# Altium schematic sheet DevModule.SchDoc
size A
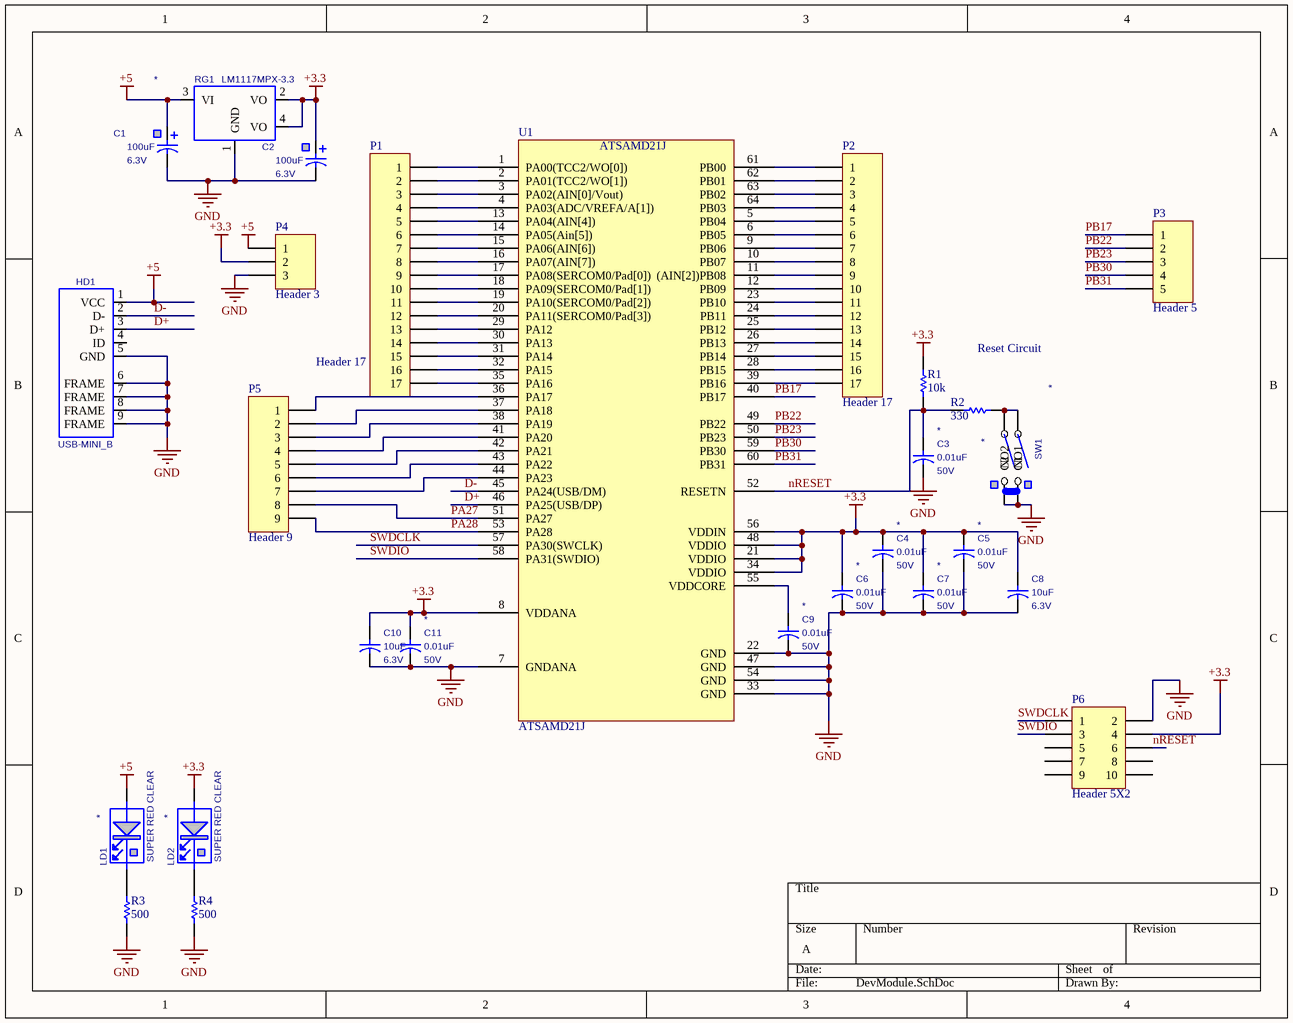
[diagram p0: DevModule.SchDoc]

## Parts
C1  value 100uF  Voltage: 6.3V  [100uF_6.3V_Tant_0805]  (hidden comment: 100UF_TANT_6.3V_0805)
C2  value 100uF  Voltage: 6.3V  [100uF_6.3V_Tant_0805]  (hidden comment: 100UF_TANT_6.3V_0805)
C3  value 0.01uF  Voltage: 50V  [RC0603REFLOW-IPC]  (hidden comment: 0.01UF_0603REFLOW)
C4  value 0.01uF  Voltage: 50V  [RC0603REFLOW-IPC]  (hidden comment: 0.01UF_0603REFLOW)
C5  value 0.01uF  Voltage: 50V  [RC0603REFLOW-IPC]  (hidden comment: 0.01UF_0603REFLOW)
C6  value 0.01uF  Voltage: 50V  [RC0603REFLOW-IPC]  (hidden comment: 0.01UF_0603REFLOW)
C7  value 0.01uF  Voltage: 50V  [RC0603REFLOW-IPC]  (hidden comment: 0.01UF_0603REFLOW)
C8  value 10uF  Voltage: 6.3V  [1206_NP_CAP]  (hidden comment: 10uF_Ceramic_6.3V)
C9  value 0.01uF  Voltage: 50V  [RC0603REFLOW-IPC]  (hidden comment: 0.01UF_0603REFLOW)
C10  value 10uF  Voltage: 6.3V  [1206_NP_CAP]  (hidden comment: 10uF_Ceramic_6.3V)
C11  value 0.01uF  Voltage: 50V  [RC0603REFLOW-IPC]  (hidden comment: 0.01UF_0603REFLOW)
HD1  USB-MINI_B  [HD_USB_MINI_B]
LD1  Color: SUPER RED CLEAR  [LED0603REFLOW-IPC-COLOR]  (hidden comment: 0603_RED)
LD2  Color: SUPER RED CLEAR  [LED0603REFLOW-IPC-COLOR]  (hidden comment: 0603_RED)
P1  Header 17  [HDR1X17]
P2  Header 17  [HDR1X17]
P3  Header 5  [HDR1X5]
P4  Header 3  [HDR1X3]
P5  Header 9  [HDR1X9]
P6  Header 5X2  [HDR2X5]
R1  value 10k  [RESC2012L]  (hidden comment: Res Semi)
R2  value 330  [RESC2012L]  (hidden comment: Res Semi)
R3  value 500  [RESC2012L]  (hidden comment: Res Semi)
R4  value 500  [RESC2012L]  (hidden comment: Res Semi)
RG1  value LM1117MPX-3.3  [SOT223REFLOW]  (hidden comment: LM1117SPX-3.3_SOT223)
SW1  SW-PCB-4P-6MM  [SW-PCB-4PIN]  (value not drawn)
U1  ATSAMD21J  [64-TQFP]

## Nets
+3.3: C2.1(+) C4.1(pin1) C5.1(pin1) C6.1(pin1) C7.1(pin1) C8.1(pin1) C10.1(pin1) C11.1(pin1) LD2.2(ANODE) P4.2 P6.4 R1.2 RG1.2(VO) RG1.4(VO) U1.8(VDDANA) U1.21(VDDIO) U1.34(VDDIO) U1.48(VDDIO) U1.56(VDDIN)
+5: C1.1(+) HD1.1(VCC) LD1.2(ANODE) P4.1 RG1.3(VI)
GND: C1.2(-) C2.2(-) C3.2(pin2) C4.2(pin2) C5.2(pin2) C6.2(pin2) C7.2(pin2) C8.2(pin2) C9.2(pin2) C10.2(pin2) C11.2(pin2) HD1.5(GND) HD1.6(FRAME) HD1.7(FRAME) HD1.8(FRAME) HD1.9(FRAME) P4.3 P6.2 R3.1 R4.1 RG1.1(GND) SW1.1(C1) SW1.2(C2) U1.7(GNDANA) U1.22(GND) U1.33(GND) U1.47(GND) U1.54(GND)
D+: HD1.3(D+) U1.46(PA25(USB/DP))
D-: HD1.2(D-) U1.45(PA24(USB/DM))
nRESET: C3.1(pin1) P6.6 R1.1 R2.1 U1.52(RESETN)
PA27: P5.8 U1.51(PA27)
PA28: P5.9 U1.53(PA28)
PB17: P3.1 U1.40(PB17)
PB22: P3.2 U1.49(PB22)
PB23: P3.3 U1.50(PB23)
PB30: P3.4 U1.59(PB30)
PB31: P3.5 U1.60(PB31)
SWDCLK: P6.1 U1.57(PA30(SWCLK))
SWDIO: P6.3 U1.58(PA31(SWDIO))
NetC9_1: C9.1(pin1) U1.55(VDDCORE)
NetLD1_1: LD1.1(CATHODE) R3.2
NetLD2_1: LD2.1(CATHODE) R4.2
NetP1_1: P1.1 U1.1(PA00(TCC2/WO[0]))
NetP1_2: P1.2 U1.2(PA01(TCC2/WO[1]))
NetP1_3: P1.3 U1.3(PA02(AIN[0]/Vout))
NetP1_4: P1.4 U1.4(PA03(ADC/VREFA/A[1]))
NetP1_5: P1.5 U1.13(PA04(AIN[4]))
NetP1_6: P1.6 U1.14(PA05(Ain[5]))
NetP1_7: P1.7 U1.15(PA06(AIN[6]))
NetP1_8: P1.8 U1.16(PA07(AIN[7]))
NetP1_9: P1.9 U1.17(PA08(SERCOM0/Pad[0]))
NetP1_10: P1.10 U1.18(PA09(SERCOM0/Pad[1]))
NetP1_11: P1.11 U1.19(PA10(SERCOM0/Pad[2]))
NetP1_12: P1.12 U1.20(PA11(SERCOM0/Pad[3]))
NetP1_13: P1.13 U1.29(PA12)
NetP1_14: P1.14 U1.30(PA13)
NetP1_15: P1.15 U1.31(PA14)
NetP1_16: P1.16 U1.32(PA15)
NetP1_17: P1.17 U1.35(PA16)
NetP2_1: P2.1 U1.61(PB00)
NetP2_2: P2.2 U1.62(PB01)
NetP2_3: P2.3 U1.63(PB02)
NetP2_4: P2.4 U1.64(PB03)
NetP2_5: P2.5 U1.5(PB04)
NetP2_6: P2.6 U1.6(PB05)
NetP2_7: P2.7 U1.9(PB06)
NetP2_8: P2.8 U1.10(PB07)
NetP2_9: P2.9 U1.11((AIN[2])PB08)
NetP2_10: P2.10 U1.12(PB09)
NetP2_11: P2.11 U1.23(PB10)
NetP2_12: P2.12 U1.24(PB11)
NetP2_13: P2.13 U1.25(PB12)
NetP2_14: P2.14 U1.26(PB13)
NetP2_15: P2.15 U1.27(PB14)
NetP2_16: P2.16 U1.28(PB15)
NetP2_17: P2.17 U1.39(PB16)
NetP5_1: P5.1 U1.36(PA17)
NetP5_2: P5.2 U1.37(PA18)
NetP5_3: P5.3 U1.38(PA19)
NetP5_4: P5.4 U1.41(PA20)
NetP5_5: P5.5 U1.42(PA21)
NetP5_6: P5.6 U1.43(PA22)
NetP5_7: P5.7 U1.44(PA23)
NetR2_2: R2.2 SW1.3(NO2) SW1.4(NO1)

Not connected (* = marked no-connect by the designer): HD1 4(ID) 10 11; P6 5 7 8 9 10

## Notes on the sheet
- Reset Circuit

## Library data of the parts
C1 C2 = 100UF_TANT_6.3V_0805: Capacitor; CapType: General Purpose; Tolerance: +/- 20%; Polarity: Polar; Vendor: VISHAY: 298D107X06R3P2T or Exact Equivalent; Composition: Tantalum; Package: 0805; CheckedBy: Sam Rhoufiry; Leads: *; Datasheet: \\langley\electronics\accel_lib\datasheets\VISHAY_100UF_6.3V_TANT_0805_298d.pdf; ModifyDate: 06/30/2009 09:22:39; ComponentLink1Description: Datasheet; ComponentLink1URL: \\langley\electronics\accel_lib\datasheets\VISHAY_100UF_6.3V_TANT_0805_298d.pdf; HelpURL: \\langley\electronics\accel_lib\datasheets\VISHAY_100UF_6.3V_TANT_0805_298d.pdf; ComponentType: Capacitor
C3-C7 C9 C11 = 0.01UF_0603REFLOW: Capacitor; CapType: X7R; Tolerance: +/- 10%; Polarity: Non-Polar; Vendor: Kemet: C0603C103K5RACTU; Composition: Ceramic; Package: 0603; LeadSpacing: *; CheckedBy: *; ModifyDate: 04/06/2006 14:59:41; Leads: *; Datasheet: *; ComponentLink1Description: Datasheet; ComponentType: Capacitor; DNS: *
C8 C10 = 18834: Capacitor, 10uF, 6.3V, Ceramic, Y5V, -20%, +80%, Non-Polar, 1206, MURATA: GRM31MF50J106ZA01L or equivalent; plIDX: 18834; Composition: Ceramic; Package: 1206; CapType: Y5V; Tolerance: -20%, +80%; Polarity: Non-Polar; Vendor: MURATA: GRM31MF50J106ZA01L or equivalent; CheckedBy: gdeguzman; ModifyDate: 3/9/10; ComponentType: Capacitor; Supplier 1: Digi-Key; Supplier Part Number 1: 490-1845-2-ND; LastUpdatedBy: Mike Tyger; Cost: 0.01; ComponentLink4URL: https://pdm.iconfitness.com/PDM/EBOM/PartsMaintenance/PartsMaintenance.aspx?Editplidx=18834; ComponentLink4Description: PDM Parts Maintenance
HD1 = USB-MINI_B: Header; LeadSpacing: NA; HeaderType: USB Type B Mini receptacle, with mounting posts; Vendor: Hirose: UX60-MB-5ST or CMUSB-5BFMX-01-C; IDF_COMP: 1; Pins: 5 pin; DNS: *; CheckedBy: T. Hayes; Datasheet: G:\accel_lib\datasheets\USB-Hirose.pdf; ComponentHeight: 156mil; ModifyDate: 10/12/10; Value: *; ComponentLink1Description: Datasheet; ComponentLink1URL: G:\accel_lib\datasheets\USB-Hirose.pdf; ComponentType: Header
LD1 LD2 = 0603_RED: LED; Value: {Value}; Shape: Rectangle; LEDType: Diffused; Vendor: Lite-on:LTST-C190KRKT or equivalent; PackageOutlineLayer: PackageOutline; IDF_COMP: 1; Package: 0603; CheckedBy: Elton John; Datasheet: G:\accel_lib\datasheets\LTST-C190KRKT.pdf; ModifyDate: 02/08/2007 16:42:04; ComponentHeight: 32mil; ComponentLink1Description: Datasheet; ComponentLink1URL: G:\accel_lib\datasheets\LTST-C190KRKT.pdf; HelpURL: G:\accel_lib\datasheets\LTST-C190KRKT.pdf; ComponentType: LED; DNS: *
P1 P2 = Header 17: Header, 17-Pin; LatestRevisionDate: 17-Jul-2002; LatestRevisionNote: Re-released for DXP Platform.; Publisher: Altium Limited
P3 = Header 5: Header, 5-Pin; LatestRevisionDate: 17-Jul-2002; LatestRevisionNote: Re-released for DXP Platform.; Publisher: Altium Limited
P4 = Header 3: Header, 3-Pin; LatestRevisionDate: 17-Jul-2002; LatestRevisionNote: Re-released for DXP Platform.; Publisher: Altium Limited
P5 = Header 9: Header, 9-Pin; LatestRevisionDate: 17-Jul-2002; LatestRevisionNote: Re-released for DXP Platform.; Publisher: Altium Limited
P6 = Header 5X2: Header, 5-Pin, Dual row; LatestRevisionDate: 17-Jul-2002; LatestRevisionNote: Re-released for DXP Platform.; Publisher: Altium Limited
R1-R4 = Res Semi: Semiconductor Resistor; Published: 8-Jun-2000; LatestRevisionDate: 17-Jul-2002; LatestRevisionNote: Re-released for DXP Platform.; PackageReference: AXIAL-0.5; Publisher: Altium Limited
RG1 = LM1117SPX-3.3_SOT223: Regulator; Voltage: 3.3V; Amperage: 800mA; RegulatorType: LDO; Vendor: National: LM1117MPX-3.3; PackageOutlineLayer: PackageOutline; IDF_COMP: 1; Package: SOT223; CheckedBy: B. Lyon; Datasheet: G:\accel_lib\datasheets\LM1117-national.pdf; ComponentHeight: 63mil; ModifyDate: 07/10/2007 16:11:35; ComponentLink1Description: Datasheet; ComponentLink1URL: G:\accel_lib\datasheets\LM1117-national.pdf; HelpURL: G:\accel_lib\datasheets\LM1117-national.pdf; ComponentType: Regulator; DNS: *
SW1 = SW-PCB-4P-6MM: Switch; Vendor: Panasonic: EVQ-PAC04M; SwitchType: momentary on; Circuit: SPST; Actuator: push-button; Package: PCB mount; CheckedBy: *; Datasheet: *; ComponentLink1Description: Datasheet; ComponentType: Switch; DNS: *; Value: *